# Altium schematic sheet ct_switching.SchDoc: Triumvi - CT Switching
size Letter; Author: Ye-Sheng Kuo; Revision: 12; SheetNumber: 7; SheetTotal: 9
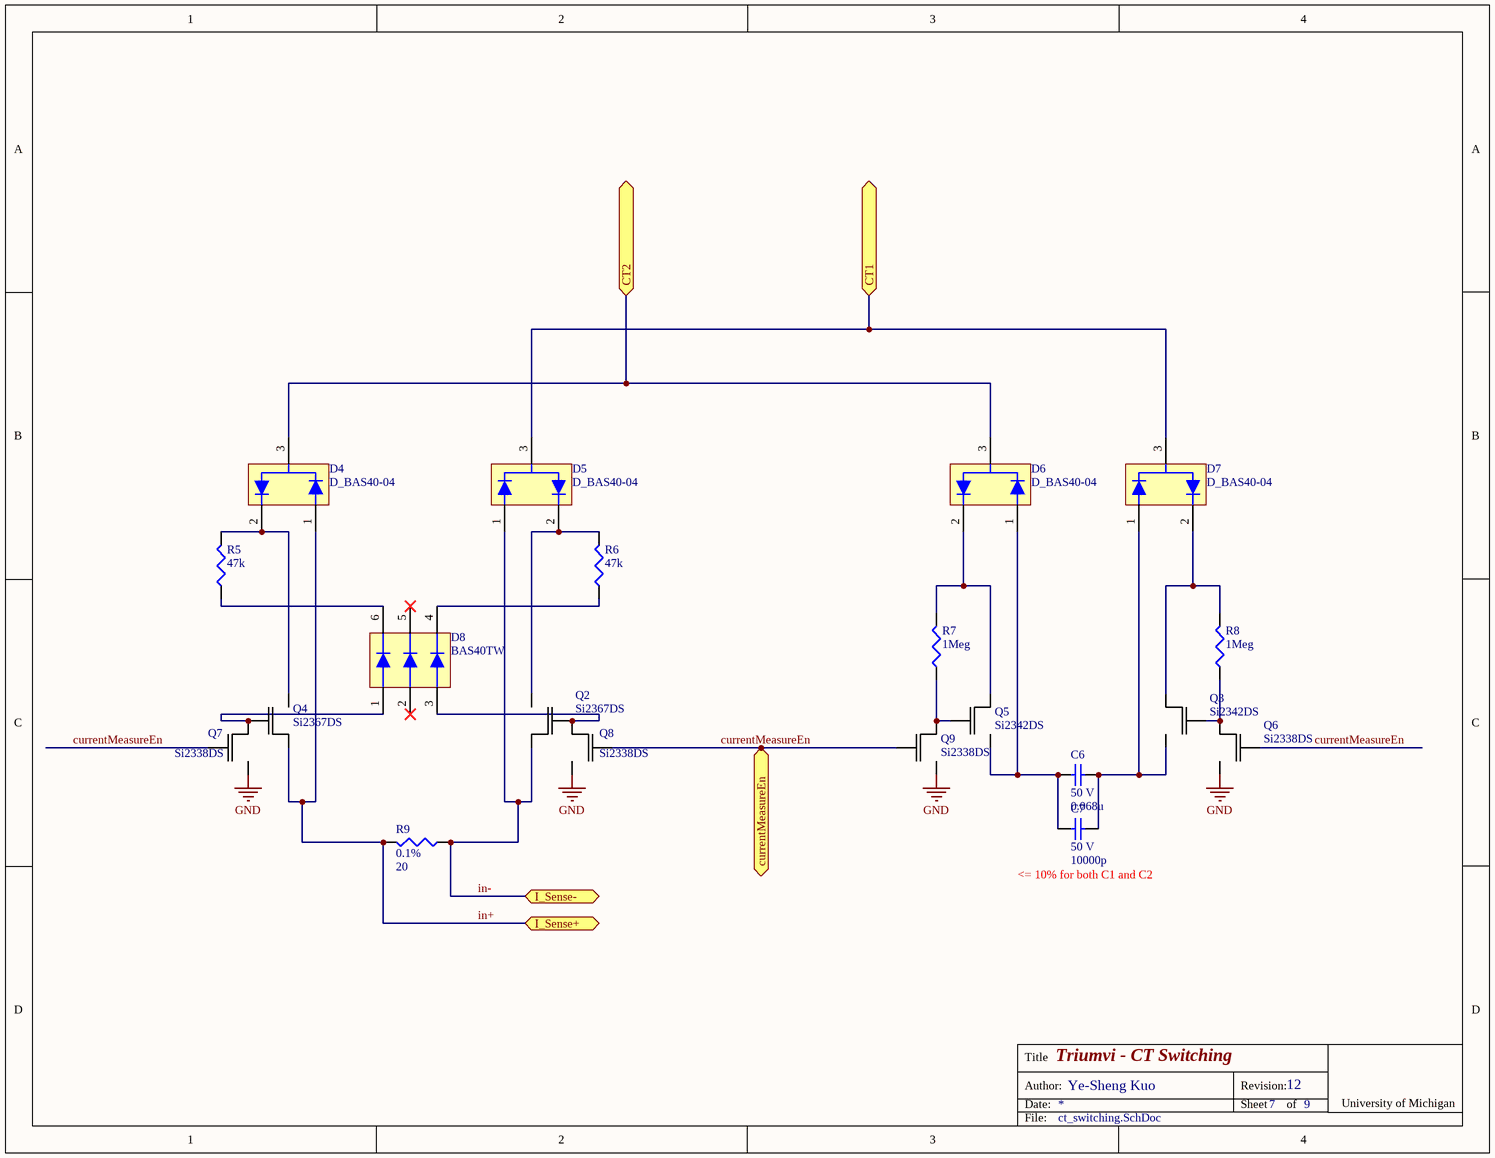
[diagram p0: ct_switching.SchDoc]

## Parts
C6  voltage rated: 50 V  [0603]  (hidden comment: 0.068u)
C7  voltage rated: 50 V  [0603]  (hidden comment: 10000p)
D4  D_BAS40-04  [SOT23-3]
D5  D_BAS40-04  [SOT23-3]
D6  D_BAS40-04  [SOT23-3]
D7  D_BAS40-04  [SOT23-3]
D8  BAS40TW  [SOT-363]
Q2  Si2367DS  [SOT23-3]
Q3  Si2342DS  [SOT23-3]
Q4  Si2367DS  [SOT23-3]
Q5  Si2342DS  [SOT23-3]
Q6  Si2338DS  [SOT23-3]
Q7  Si2338DS  [SOT23-3]
Q8  Si2338DS  [SOT23-3]
Q9  Si2338DS  [SOT23-3]
R5  47k  [0402]
R6  47k  [0402]
R7  1Meg  [0402]
R8  1Meg  [0402]
R9  Tolerance: 0.1%  [0805]  (hidden comment: 20)

## Ports
CT1, CT2, currentMeasureEn, I_Sense+, I_Sense-

## Nets
GND: Q6.2(S) Q7.2(S) Q8.2(S) Q9.2(S)
CT1: D5.3 D7.3 ; port CT1
CT2: D4.3 D6.3 ; port CT2
currentMeasureEn: Q6.1(G) Q7.1(G) Q8.1(G) Q9.1(G) ; port currentMeasureEn
in+: D4.1 Q4.3(D) R9.1 ; port I_Sense+
in-: D5.1 Q2.3(D) R9.2 ; port I_Sense-
NetC6_1: C6.1 C7.1 D6.1 Q5.2(S)
NetC6_2: C6.2 C7.2 D7.1 Q3.2(S)
NetD4_2: D4.2 Q4.2(S) R5.1
NetD5_2: D5.2 Q2.2(S) R6.1
NetD6_2: D6.2 Q5.3(D) R7.1
NetD7_2: D7.2 Q3.3(D) R8.1
NetD8_1: D8.1 Q4.1(G) Q7.3(D)
NetD8_3: D8.3 Q2.1(G) Q8.3(D)
NetD8_4: D8.4 R6.2
NetD8_6: D8.6 R5.2
NetQ3_1: Q3.1(G) Q6.3(D) R8.2
NetQ5_1: Q5.1(G) Q9.3(D) R7.2

Not connected (* = marked no-connect by the designer): D8 2* 5*

## Notes on the sheet
- (near C7) <= 10% for both C1 and C2
- Title
- Date:
- Author:
- Revision:
- Sheet
- of
- University of Michigan
- File:

## Library data of the parts
C6 = C0603C683K5RACTU: 0.068µF ±10% 50V Ceramic Capacitor X7R 0603; Manufacture: Kemet; tolerance: 10%; package: 0603; Supplier 1: Digi-Key; Supplier Part Number 1: 399-7955-1-ND; Value: 0.068u; Temperature Coefficient: X7R; Manufacturer Part Number: C0603C683K5RACTU
C7 = C0603C103J5RACTU: 10000pF ±5% 50V Ceramic Capacitor X7R 0603; Manufacture: Kemet; tolerance: 5%; package: 0603; Supplier 1: Digi-Key; Supplier Part Number 1: 399-1092-6-ND; Value: 10000p; Temperature Coefficient: X7R; Manufacturer Part Number: C0603C103J5RACTU
D4-D7 = D_BAS40-04: SURFACE MOUNT SCHOTTKY BARRIER DIODE; Supplier 1: Digi-Key; Supplier Part Number 1: BAS40-04FDICT-ND
D8 = D_BAS40TW: SURFACE MOUNT SCHOTTKY BARRIER DIODE ARRAYS; Supplier 1: Digi-Key; Supplier Part Number 1: BAS40TW-FDICT-ND
Q2 Q4 = Si2367DS: P-Channel 20 V (D-S) MOSFET; Supplier 1: Digi-Key; Supplier Part Number 1: SI2367DS-T1-GE3CT-ND
Q3 Q5 = Si2342DS: N-Channel 8 V (D-S) MOSFET; Supplier 1: Digi-Key; Supplier Part Number 1: SI2342DS-T1-GE3CT-ND
Q6-Q9 = Si2338DS: N-Channel 30 V (D-S) MOSFET; Supplier 1: Digi-Key; Supplier Part Number 1: SI2338DS-T1-GE3CT-ND
R5 R6 = CRCW040247K0FKED: RES SMD 47K OHM 1% 1/16W 0402; Manufacturer: Vishay Dale; Temperature Coefficient: 100 ppm/C; Tolerance: 1%; Power: 1/16 W; package: 0402; Supplier 1: Digi-Key; Supplier Part Number 1: 541-47.0KLCT-ND; value: 47k; Manufacturer Part Number: CRCW040247K0FKED
R7 R8 = CRCW04021M00FKED: RES SMD 1M OHM 1% 1/16W 0402; Manufacturer: Vishay Dale; Temperature Coefficient: 100 ppm/C; Tolerance: 1%; Power: 1/16 W; Supplier 1: Digi-Key; Supplier Part Number 1: 541-1.00MLCT-ND; package: 0402; value: 1Meg; Manufacturer Part Number: CRCW04021M00FKED
R9 = RTAN0805BKE20R0: RES SMD 20 OHM 0.1% 1/5W 0805; Manufacturer: Stackpole Electronics Inc.; Temperature Coefficient: 25 ppm/C; Power: 0.2 W; package: 0805; Manufacturer Part Number: RTAN0805BKE20R0; Supplier 1: Digi-Key; Supplier Part Number 1: RTAN0805BKE20R0CT-ND; value: 20